# Altium schematic sheet MCU_Platform.SchDoc
size A4; SheetNumber: 2; SheetTotal: 6
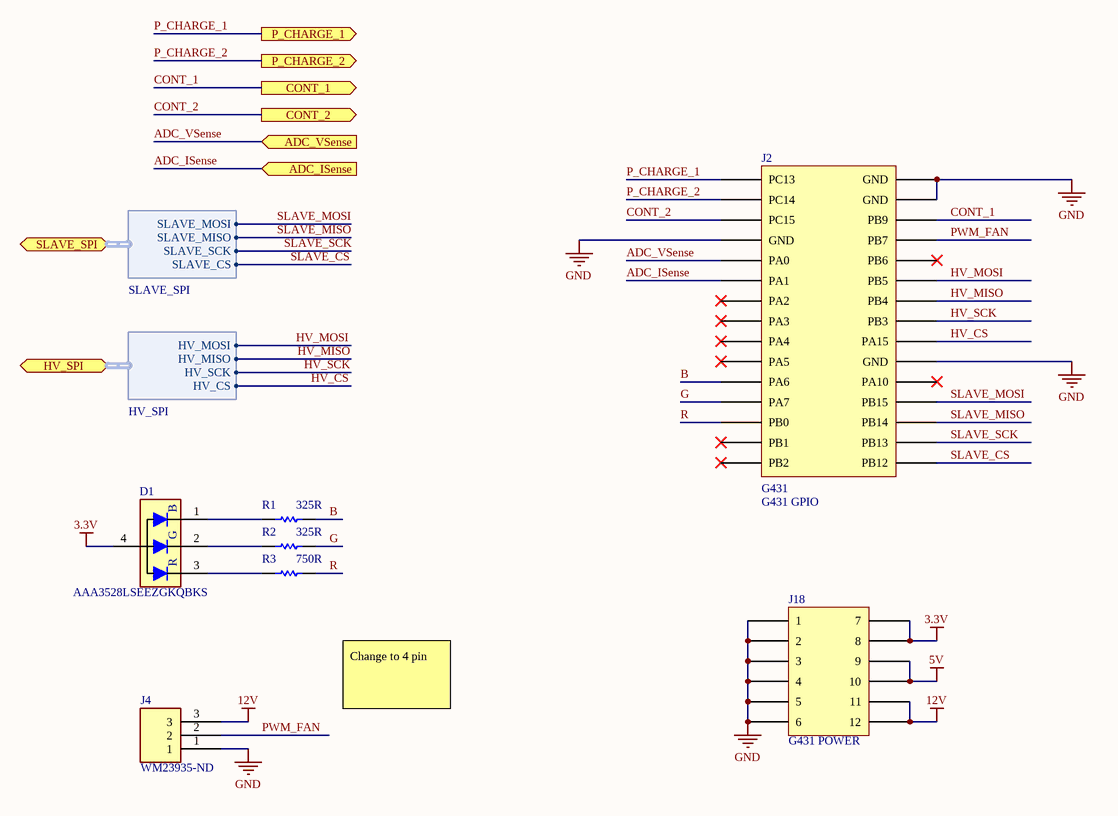
[diagram p0: MCU_Platform.SchDoc]

## Parts
D1  AAA3528LSEEZGKQBKS  [4-PLCC RGB LED]
J2  G431 GPIO  [G431 Header (GPIO Connector)]
J4  WM23935-ND  [MOLEX_39303037]
J18  G431 POWER  [G431 HEADER (POWER CONNECTOR)]
R1  value 325R  [0603 - Resistor]  (hidden comment: 1%)
R2  value 325R  [0603 - Resistor]  (hidden comment: 1%)
R3  value 750R  [0603 - Resistor]  (hidden comment: 1%)

## Ports
ADC_ISense (in), ADC_VSense (in), CONT_1 (out), CONT_2 (out), HV_SPI (bidir, harness HV_SPI), P_CHARGE_1 (out), P_CHARGE_2 (out), SLAVE_SPI (bidir, harness SLAVE_SPI)

## Harnesses
SLAVE_SPI: SLAVE_MOSI, SLAVE_MISO, SLAVE_SCK, SLAVE_CS
HV_SPI: HV_MOSI, HV_MISO, HV_SCK, HV_CS

## Nets
3.3V: D1.4 J18.7 J18.8
5V: J18.9 J18.10
12V: J4.3 J18.11 J18.12
GND: J2.4(GND) J2.16(GND) J2.17(GND) J2.25(GND) J4.1 J18.1 J18.2 J18.3 J18.4 J18.5 J18.6
ADC_ISense: J2.6(PA1) ; port ADC_ISense
ADC_VSense: J2.5(PA0) ; port ADC_VSense
B: J2.11(PA6) R1.1
CONT_1: J2.18(PB9) ; port CONT_1
CONT_2: J2.3(PC15) ; port CONT_2
G: J2.12(PA7) R2.1
HV_CS: J2.24(PA15) ; port HV_SPI.HV_CS
HV_MISO: J2.22(PB4) ; port HV_SPI.HV_MISO
HV_MOSI: J2.21(PB5) ; port HV_SPI.HV_MOSI
HV_SCK: J2.23(PB3) ; port HV_SPI.HV_SCK
P_CHARGE_1: J2.1(PC13) ; port P_CHARGE_1
P_CHARGE_2: J2.2(PC14) ; port P_CHARGE_2
PWM_FAN: J2.19(PB7) J4.2
R: J2.13(PB0) R3.1
SLAVE_CS: J2.30(PB12) ; port SLAVE_SPI.SLAVE_CS
SLAVE_MISO: J2.28(PB14) ; port SLAVE_SPI.SLAVE_MISO
SLAVE_MOSI: J2.27(PB15) ; port SLAVE_SPI.SLAVE_MOSI
SLAVE_SCK: J2.29(PB13) ; port SLAVE_SPI.SLAVE_SCK
NetD1_1: D1.1 R1.2
NetD1_2: D1.2 R2.2
NetD1_3: D1.3 R3.2

Not connected (* = marked no-connect by the designer): J2 7(PA2)* 8(PA3)* 9(PA4)* 10(PA5)* 14(PB1)* 15(PB2)* 20(PB6)* 26(PA10)*

## Notes on the sheet
- Change to 4 pin
- Title:
- Size:
- Date:
- A4
- Author:
- Revision:
- Sheet
- of
- File:
- (in symbol G431 GPIO) G431
- (in symbol RGB LED- Common Anode) B; G; R

## Library data of the parts
D1 = RGB LED- Common Anode: Red, Green, Blue (RGB) 621nm Red, 525nm Green, 465nm Blue LED Indication - Discrete 1.8V Red, 2.7V Green, 2.7V Blue 4-PLCC; Manufacturer: Kingbright; Manufacturer Part Number: AAA3528LSEEZGKQBKS; Supplier Part Number: 754-1967-1-ND; Supplier: Digi-Key
J2 = G431 GPIO: PPPC152LJBN-RC (30 Position Header Connector 0.100" (2.54mm) Through Hole, Right Angle Gold); Manufacturer Name: Sullins Connector Solutions; Manufacturer Part Number (CONN): PPPC152LJBN-RC; Supplier Name: Digikey; Supplier Part Number: S5568-ND
J4 = WM23935-ND: Conn Power HDR 3 POS 4.2mm Solder RA Thru-Hole 3 Terminal 1 Port Mini-Fit Jr Bag; MP: 39303037; MF: Molex; Package: None; Purchase-URL: https://pricing.snapeda.com/search/part/39303037/?ref=eda; Check_prices: https://www.snapeda.com/parts/39303037/Molex/view-part/?ref=eda; Value: *; SnapEDA_Link: https://www.snapeda.com/parts/39303037/Molex/view-part/?ref=snap; ComponentLink1Description: Manufacturer name; ComponentLink1URL: Molex; ComponentLink2Description: Manufacturer part number; ComponentLink2URL: 0039303037; ComponentLink3Description: Supplier name; ComponentLink3URL: Digikey; ComponentLink4Description: Supplier part number; ComponentLink4URL: WM23935-ND
J18 = G431 POWER: PPPC062LJBN-RC (12 Position Header Connector 0.100" (2.54mm) Through Hole, Right Angle Gold); Manufacturer Name: Sullins Connector Solutions; Manufacturer Part Number: PPPC062LJBN-RC; Supplier Name: Digikey; Supplier Part Number: S5559-ND
R1-R3 = Resistor: RC0603FR-07232RL, RES 232 OHM 1% 1/10W 0603; Manufacturer: YAGEO; Rating: 0.1W; Manufacturer Part Number: RC0603FR-07232RL; Supplier Part Number: 311-232HRCT-ND; Supplier: Digi-Key